# EAGLE design schematic (EAGLE 9.4.1)
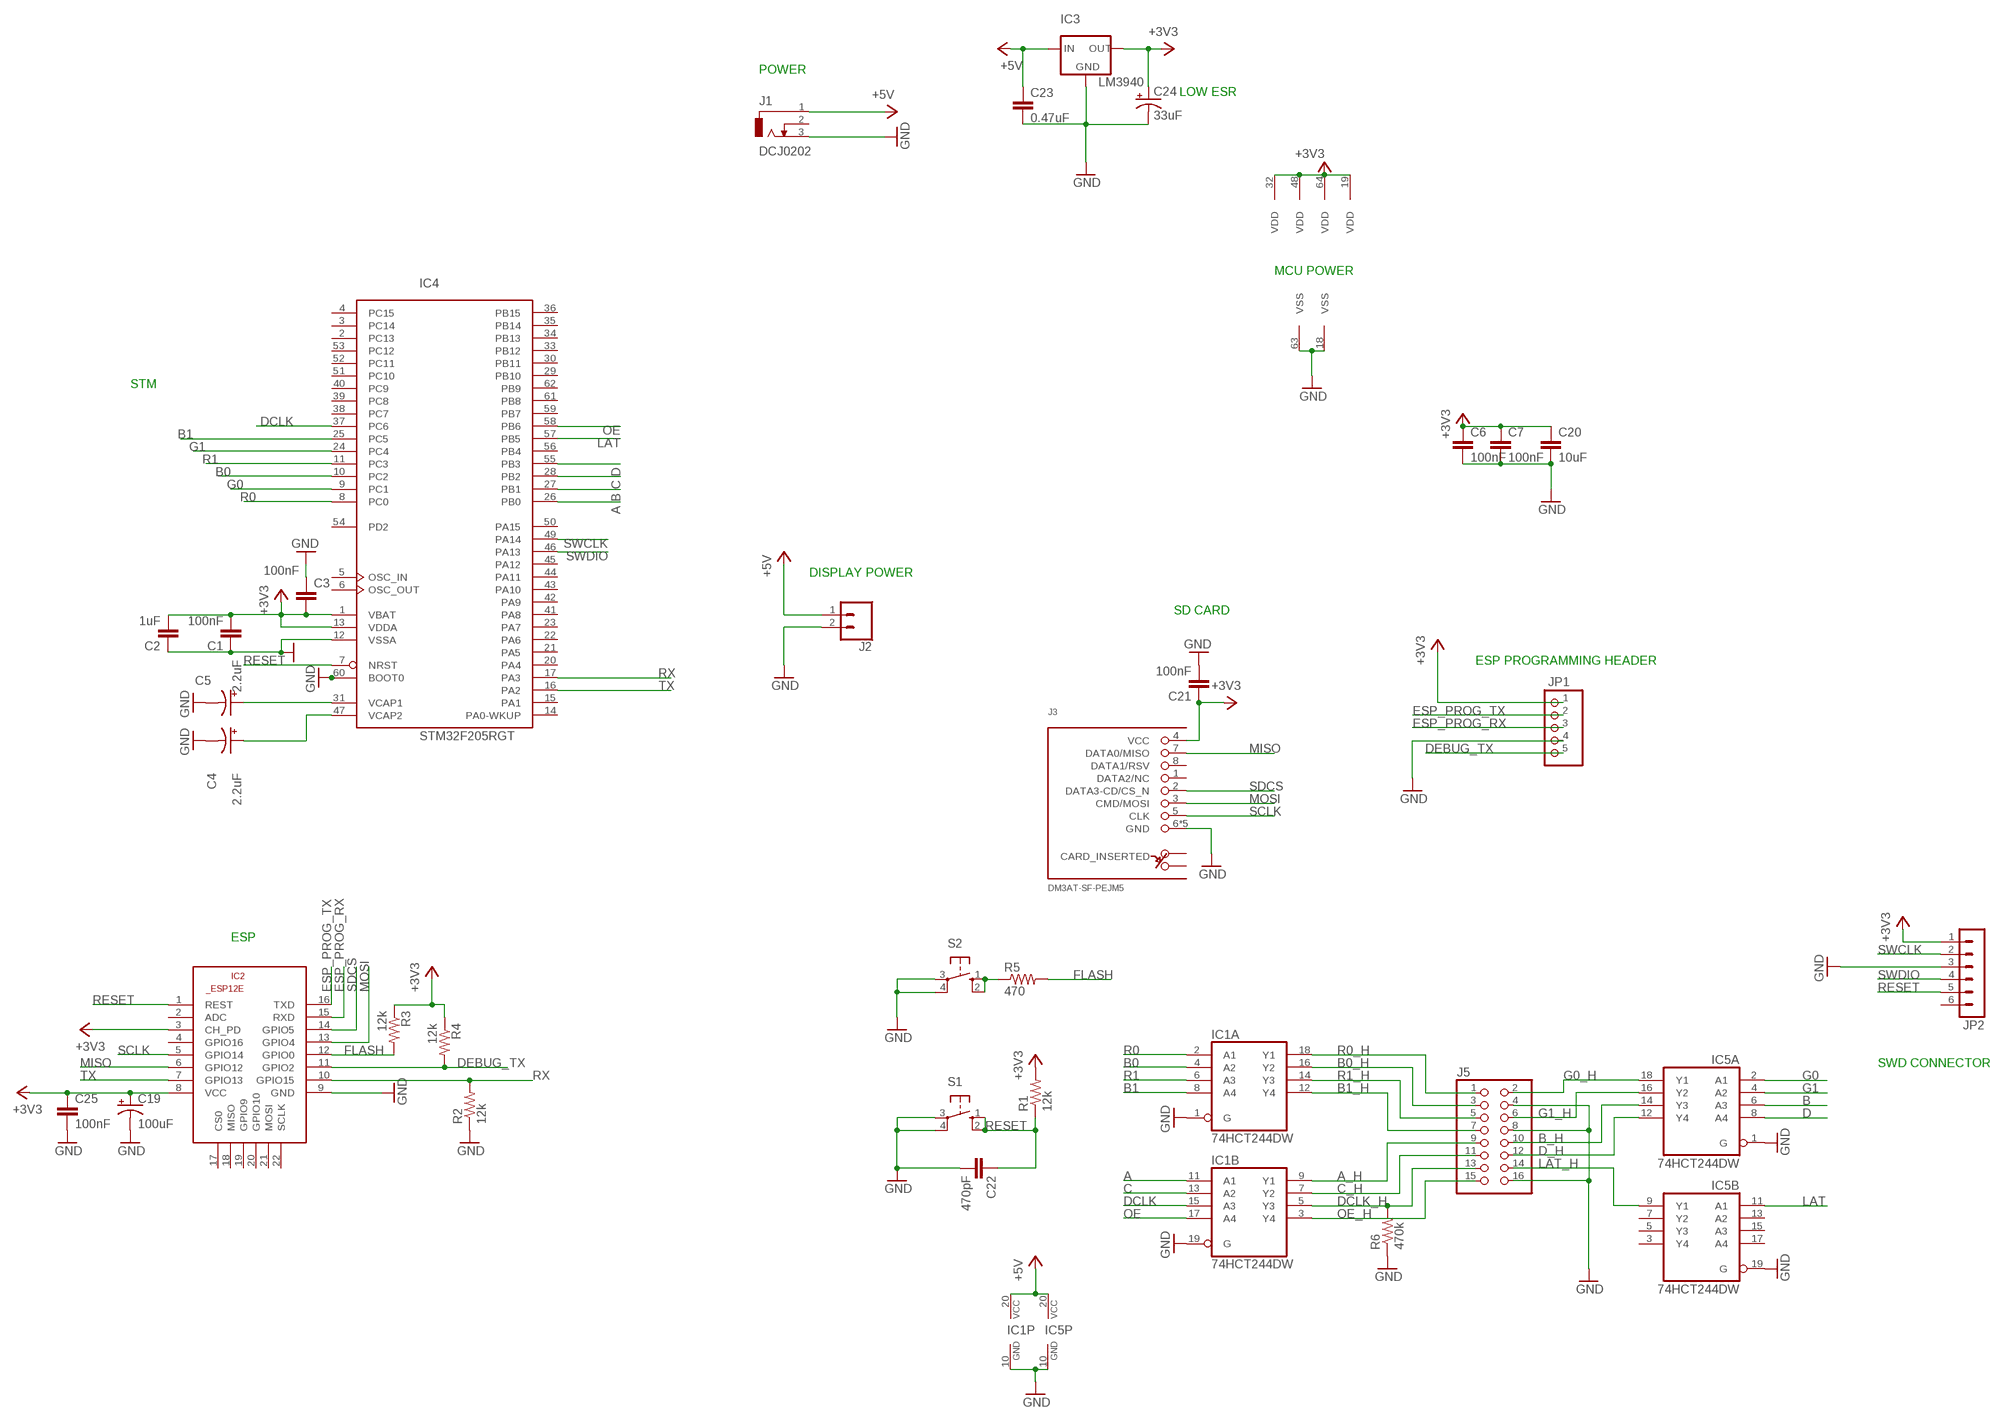
[diagram p0: schematic, sheet 1]

## Parts
C1  100nF  C-EU025-025X050  [C025-025X050]
C2  1uF  C-EU050-024X044  [C050-024X044]
C3  100nF  C-EU025-025X050  [C025-025X050]
C4  2.2uF  CPOL-USE1.8-4  [E1,8-4]
C5  2.2uF  CPOL-USE1.8-4  [E1,8-4]
C6  100nF  C-EU025-025X050  [C025-025X050]
C7  100nF  C-EU025-025X050  [C025-025X050]
C19  100uF  CPOL-USE2.5-6  [E2,5-6]
C20  10uF  C-EU025-025X050  [C025-025X050]
C21  100nF  C-EU025-025X050  [C025-025X050]
C22  470pF  C-EU025-025X050  [C025-025X050]
C23  0.47uF  C-EU050-024X044  [C050-024X044]
C24  33uF  CPOL-USE2-5  [E2-5]
C25  100nF  C-EU025-025X050  [C025-025X050]
IC1  74HCT244DW  [SO20W]
IC2  ESP8266-12EESP12E  [ESP8266-ESP12E]
IC3  LM3940  [TO220]
IC4  STM32F205RGT  [LQFP64]
IC5  74HCT244DW  [SO20W]
J1  DCJ0202  [DCJ0202]
J2  CONN_025MM  [SCREWTERMINAL-5MM-2]
J3  DM3AT-SF-PEJM5  [DM3AT-SF-PEJM5]
J5  PINHD-2X8  [2X08]
JP1  PINHD-1X5  [1X05]
JP2  MA06-1  [MA06-1]
R1  12k  R-US_0204/7  [0204/7]
R2  12k  R-US_0204/7  [0204/7]
R3  12k  R-US_0204/7  [0204/7]
R4  12k  R-US_0204/7  [0204/7]
R5  470  R-US_0204/7  [0204/7]
R6  470k  R-US_0204/7  [0204/7]
S1  10-XX  [B3F-10XX]
S2  10-XX  [B3F-10XX]

## Nets
+3V3: C6.1 C7.1 C19.+ C20.1 C21.1 C24.+ C25.1 IC2.3(CH_PD) IC2.8(VCC) IC3.3(OUT) IC4.19(VDD) IC4.32(VDD) IC4.48(VDD) IC4.64(VDD) J3.4(VCC) JP1.1 JP2.1 R1.2 R3.1 R4.1
+5V: C23.1 IC1.20(P:VCC) IC3.1(IN) IC5.20(P:VCC) J1.1 J2.1
A: IC1.11(B:A1) IC4.26(PB0)
A_H: IC1.9(B:Y1) J5.9
B: IC4.27(PB1) IC5.6(A:A3)
B0: IC1.4(A:A2) IC4.10(PC2)
B0_H: IC1.16(A:Y2) J5.3
B1: IC1.8(A:A4) IC4.25(PC5)
B1_H: IC1.12(A:Y4) J5.7
B_H: IC5.14(A:Y3) J5.10
C: IC1.13(B:A2) IC4.28(PB2)
C_H: IC1.7(B:Y2) J5.11
D: IC4.55(PB3) IC5.8(A:A4)
D_H: IC5.12(A:Y4) J5.12
DCLK: IC1.15(B:A3) IC4.37(PC6)
DCLK_H: IC1.5(B:Y3) J5.13 R6.2
DEBUG_TX: IC2.11(GPIO2) JP1.5 R4.2
ESP_PROG_RX: IC2.15(RXD) JP1.3
ESP_PROG_TX: IC2.16(TXD) JP1.2
FLASH: IC2.12(GPIO0) R3.2 R5.2
G0: IC4.9(PC1) IC5.2(A:A1)
G0_H: IC5.18(A:Y1) J5.2
G1: IC4.24(PC4) IC5.4(A:A2)
G1_H: IC5.16(A:Y2) J5.6
GND: C1.1 C2.1 C3.1 C4.- C5.- C6.2 C7.2 C19.- C20.2 C21.2 C22.2 C23.2 C24.- C25.2 IC1.1(A:G) IC1.10(P:GND) IC1.19(B:G) IC2.9(GND) IC3.2(GND) IC4.12(VSSA) IC4.18(VSS) IC4.60(BOOT0) IC4.63(VSS) IC5.1(A:G) IC5.10(P:GND) IC5.19(B:G) J1.3 J2.2 J3.6(GND) J3.MOUNT0(GND) J3.MOUNT1(GND) J3.MOUNT2(GND) J3.MOUNT3(GND) J5.4 J5.8 J5.16 JP1.4 JP2.3 R2.1 R6.1 S1.3(P) S1.4(P1) S2.3(P) S2.4(P1)
LAT: IC4.57(PB5) IC5.11(B:A1)
LAT_H: IC5.9(B:Y1) J5.14
MISO: IC2.6(GPIO12) J3.7(DATA0/MISO)
MOSI: IC2.13(GPIO4) J3.3(CMD/MOSI)
N$1: R5.1 S2.1(S) S2.2(S1)
N$2: C5.+ IC4.31(VCAP1)
N$3: C4.+ IC4.47(VCAP2)
N$4: C1.2 C2.2 C3.2 IC4.1(VBAT) IC4.13(VDDA) ; supply symbol labelled +3V3
OE: IC1.17(B:A4) IC4.58(PB6)
OE_H: IC1.3(B:Y4) J5.15
R0: IC1.2(A:A1) IC4.8(PC0)
R0_H: IC1.18(A:Y1) J5.1
R1: IC1.6(A:A3) IC4.11(PC3)
R1_H: IC1.14(A:Y3) J5.5
RESET: C22.1 IC2.1(REST) IC4.7(NRST) JP2.5 R1.1 S1.1(S) S1.2(S1)
RX: IC2.10(GPIO15) IC4.17(PA3) R2.2
SCLK: IC2.5(GPIO14) J3.5(CLK)
SDCS: IC2.14(GPIO5) J3.2(DATA3-CD/CS_N)
SWCLK: IC4.49(PA14) JP2.2
SWDIO: IC4.46(PA13) JP2.4
TX: IC2.7(GPIO13) IC4.16(PA2)
Unconnected: IC2.2(ADC) IC2.4(GPIO16) IC2.17(CS0) IC2.18(MISO) IC2.19(GPIO9) IC2.20(GPIO10) IC2.21(MOSI) IC2.22(SCLK) IC4.2(PC13) IC4.3(PC14) IC4.4(PC15) IC4.5(OSC_IN) IC4.6(OSC_OUT) IC4.14(PA0-WKUP) IC4.15(PA1) IC4.20(PA4) IC4.21(PA5) IC4.22(PA6) IC4.23(PA7) IC4.29(PB10) IC4.30(PB11) IC4.33(PB12) IC4.34(PB13) IC4.35(PB14) IC4.36(PB15) IC4.38(PC7) IC4.39(PC8) IC4.40(PC9) IC4.41(PA8) IC4.42(PA9) IC4.43(PA10) IC4.44(PA11) IC4.45(PA12) IC4.50(PA15) IC4.51(PC10) IC4.52(PC11) IC4.53(PC12) IC4.54(PD2) IC4.56(PB4) IC4.59(PB7) IC4.61(PB8) IC4.62(PB9) IC5.3(B:Y4) IC5.5(B:Y3) IC5.7(B:Y2) IC5.13(B:A2) IC5.15(B:A3) IC5.17(B:A4) J1.2 J3.1(DATA2/NC) J3.8(DATA1/RSV) J3.A J3.B JP2.6

## Notes on the sheet
- POWER
- LOW ESR
- MCU POWER
- STM
- DISPLAY POWER
- SD CARD
- ESP PROGRAMMING HEADER
- ESP
- SWD CONNECTOR

## Library data of the parts
C1-C3 C6 C7 C20-C23 C25 = rcl:C-EU: CAPACITOR, European symbol; SPICEPREFIX: C
C4 C5 C19 C24 = rcl:CPOL-US: POLARIZED CAPACITOR, American symbol; SPICEPREFIX: C
IC1 IC5 = 74xx-eu:74*244: Octal BUFFER and LINE DRIVER, 3-state
IC2 = esp12e:ESP8266-12E: ESP8266-12E Library for Eagle CAD The author not responsible for any damages or errors!. Created by Suhail jr.lt;/author>
IC3 = LM3940:LM3940: LM3940 1A Low Dropout Regulator for 5V to 3.3V Conversion; AVAILABILITY: Unavailable; MF: National Semiconductor; MP: LM3940; PACKAGE: None; PRICE: None
IC4 = micro-stm_v3:STM32F205R*T: ARM 32-bit Cortex™-M3 CPU 120 MHz maximum frequency 128 to 1024 Kbytes of Flash memory 64 to 128 kbytes of SRAM 51 GPIOs 1.8 to 3.6 V application supply
J1 = con-jack:DCJ0202: DC POWER JACK Source: DCJ0202.pdf; OC_FARNELL: unknown; OC_NEWARK: unknown
J2 = SparkFun-Connectors:CONN_02: Multi connection point. Often used as Generic Header-pin footprint for 0.1 inch spaced/style header connections On any of the 0.1 inch spaced packages, you can populate with these: Break Away Headers - Straight <https://www.sparkfun.com/products/116> (PRT-00116) Break Away Male Headers - Right Angle <https://www.sparkfun.com/products/553> (PRT-00553) Female Headers <https://www.sparkfun.com/products/115> (PRT-00115) Break Away Headers - Machine Pin <https://www.sparkfun.com/products/117> (PRT-00117) Break Away Female Headers - Swiss Machine Pin <https://www.sparkfun.com/products/743> (PRT-00743) For SCREWTERMINALS and SPRING TERMINALS visit here: Screw Terimnals on SparkFun.com <https://www.sparkfun.com/search/results?term=Screw+Terminals> (5mm/3.5mm/2.54mm spacing) This device is also useful as a general connection point to wire up your design to another part of your project. Our various solder wires solder well into these plated through hole pads. Hook-Up Wire - Assortment (Stranded, 22 AWG) <https://www.sparkfun.com/products/11375> (PRT-11375) Hook-Up Wire - Assortment (Solid Core, 22 AWG) <https://www.sparkfun.com/products/11367> (PRT-11367) View the entire wire category on our website here <https://www.sparkfun.com/categories/141> Special notes: Molex polarized connector foot print use with: PRT-08233 with associated crimp pins and housings. 2.54_SCREWTERM for use with PRT-10571. 3.5mm Screw Terminal footprints for PRT-08084 5mm Screw Terminal footprints for use with PRT-08432; SF_SKU: PRT-08432
J3 = connector:DM3AT-SF-PEJM5: CONN MICRO SD R/A PUSH-PUSH SMD; DESCRIPTION: CONN MICRO SD CARD PUSH-PUSH R/A; DIGIKEY: HR1964CT-ND; MANUFACTURER: Hirose Electric Co Ltd; MPN: DM3AT-SF-PEJM5
J5 = pinhead:PINHD-2X8: PIN HEADER
JP1 = pinhead:PINHD-1X5: PIN HEADER
JP2 = con-lstb:MA06-1: PIN HEADER; OC_FARNELL: unknown; OC_NEWARK: unknown
R1-R6 = rcl:R-US_: RESISTOR, American symbol; SPICEPREFIX: R
S1 S2 = switch-omron:10-XX: OMRON SWITCH; MPN: B3F-1000; OC_FARNELL: 176432; OC_NEWARK: 36M3542

## Board
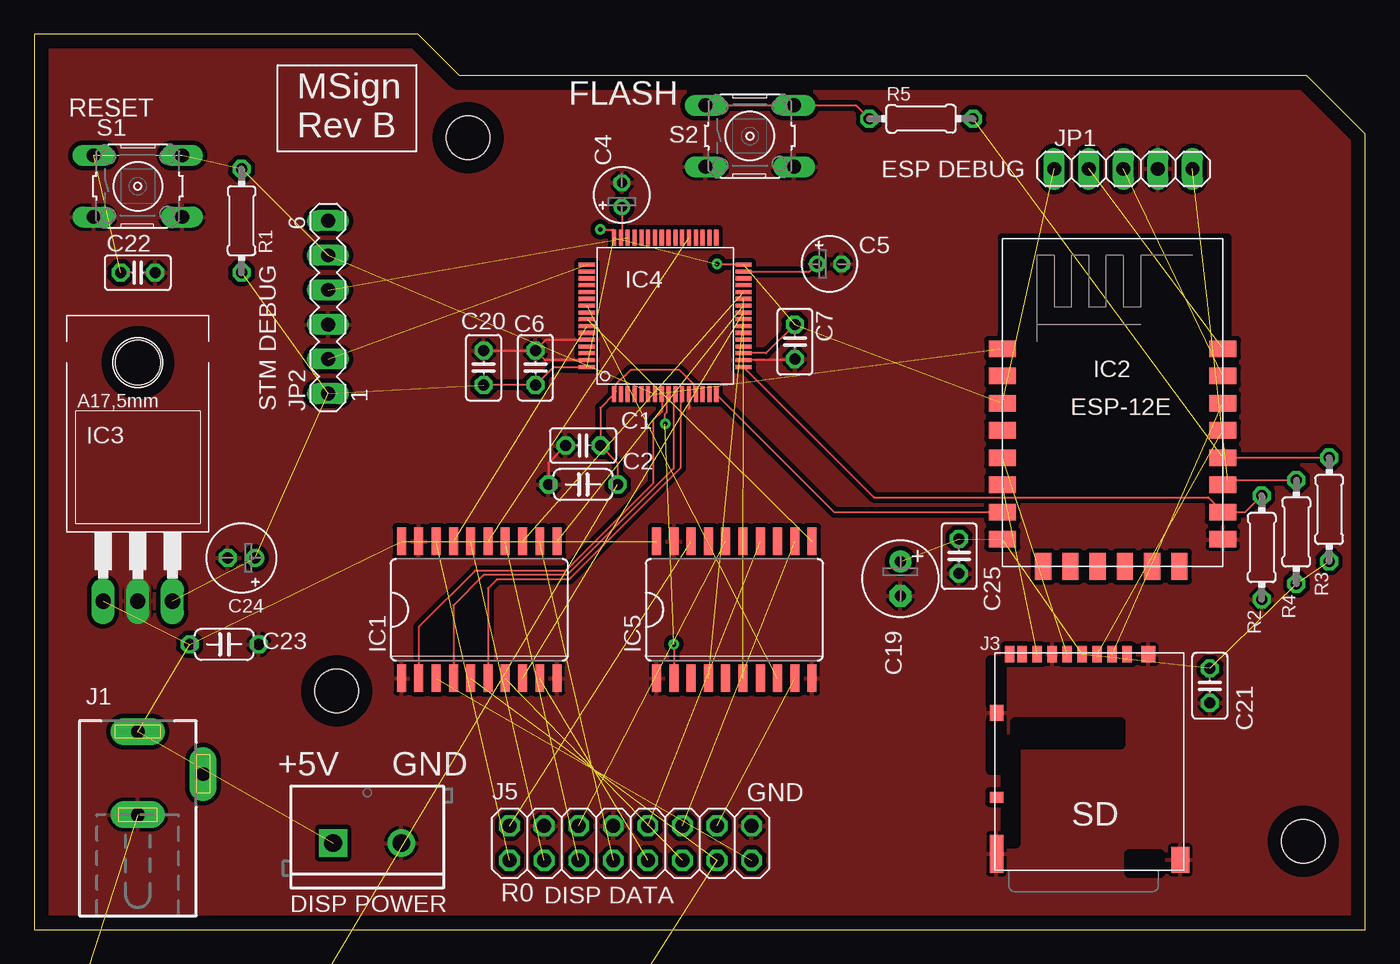
[diagram p1: board, top side]
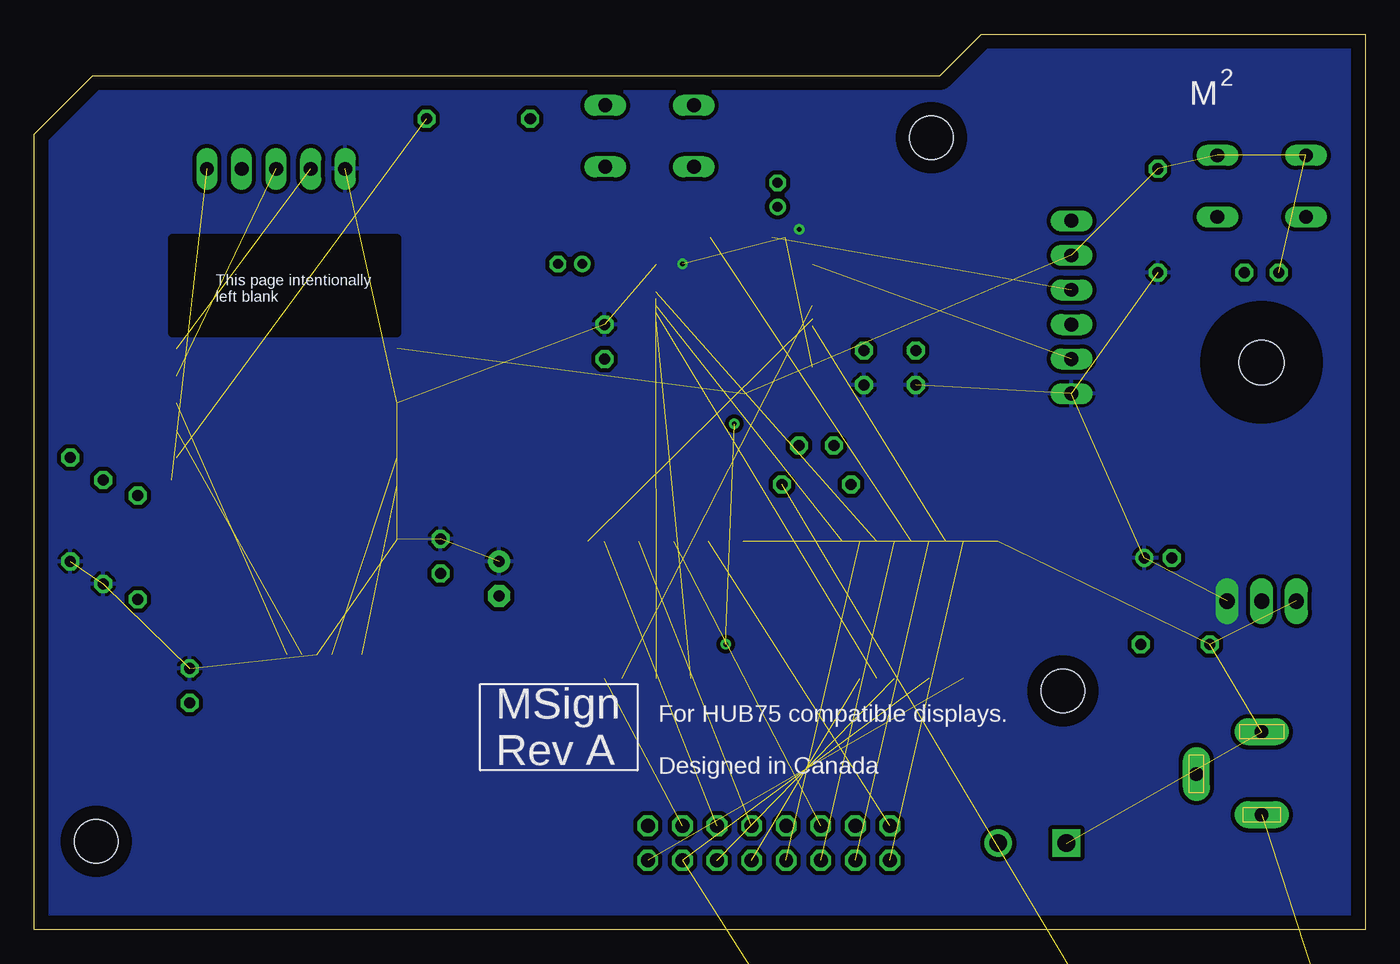
[diagram p2: board, bottom side, seen from below]

Size 97.79 x 65.79 mm. Coordinates in mm from the lower left corner, seen from the top.
Outline: 0,0 97.79,0 97.79,58.42 93.47,62.74 31.24,62.74 28.19,65.79 0,65.79 0,0
Copper layers (1*16): Top 0.035mm / dielectric 1.5mm / Bottom 0.035mm
Design rules "default": minimum track width 6mil, minimum drill 0.35mm, track to track 6mil, track to pad 6mil, pad to pad 6mil, via to via 6mil, smd to smd 6mil, copper to edge 40mil, drill to drill 6mil, minimum pad ring 10mil, minimum via ring 8mil, stop-mask expansion 4mil, vias tented up to drill 0mil, thermal gap 10mil
Holes 3.2 mm at 31.88,58.17 22.23,17.53 93.22,6.48

### Footprints (pad centres in the part's own frame; a part is rotated, then mirrored left to right if it is on the bottom)
C025-025X050 = drill 0.813 octagon: 1 -1.27,0; 2 1.27,0
C050-024X044 = drill 0.813 octagon: 1 -2.54,0; 2 2.54,0
E1,8-4 = drill 0.711 pad 1.168: + -0.889,0 | drill 0.711 pad 1.168 octagon: - 0.889,0
E2,5-6 = drill 0.813 pad 1.6: + -1.27,0 | drill 0.813 pad 1.6 octagon: - 1.27,0
E2-5 = drill 0.813 pad 1.27: + -1.016,0 | drill 0.813 pad 1.27 octagon: - 1.016,0
SO20W = smd 0.66 x 2.032: 1 -5.715,-5.029; 2 -4.445,-5.029; 3 -3.175,-5.029; 4 -1.905,-5.029; 5 -0.635,-5.029; 6 0.635,-5.029; 7 1.905,-5.029; 8 3.175,-5.029; 9 4.445,-5.029; 10 5.715,-5.029; 11 5.715,5.029; 12 4.445,5.029; 13 3.175,5.029; 14 1.905,5.029; 15 0.635,5.029; 16 -0.635,5.029; 17 -1.905,5.029; 18 -3.175,5.029; 19 -4.445,5.029; 20 -5.715,5.029
ESP8266-ESP12E = smd 2 x 1.2: 1 -7.62,5.84; 2 -7.62,3.84; 3 -7.62,1.84; 4 -7.62,-0.16; 5 -7.62,-2.16; 6 -7.62,-4.16; 7 -7.62,-6.16; 8 -7.62,-8.16; 9 8.58,-8.16; 10 8.58,-6.16; 11 8.58,-4.16; 12 8.58,-2.16; 13 8.58,-0.16; 14 8.58,1.84; 15 8.58,3.84; 16 8.58,5.84 | smd 1.2 x 2: 17 -4.62,-10.16; 18 -2.62,-10.16; 19 -0.62,-10.16; 20 1.38,-10.16; 21 3.38,-10.16; 22 5.38,-10.16
TO220 = drill 1.118 long: 1 -2.54,-10.16; 2 0,-10.16; 3 2.54,-10.16 | hole 3.302: 0,7.366
LQFP64 = smd 0.3 x 1.2: 1 -3.75,-5.75; 2 -3.25,-5.75; 3 -2.75,-5.75; 4 -2.25,-5.75; 5 -1.75,-5.75; 6 -1.25,-5.75; 7 -0.75,-5.75; 8 -0.25,-5.75; 9 0.25,-5.75; 10 0.75,-5.75; 11 1.25,-5.75; 12 1.75,-5.75; 13 2.25,-5.75; 14 2.75,-5.75; 15 3.25,-5.75; 16 3.75,-5.75; 33 3.75,5.75; 34 3.25,5.75; 35 2.75,5.75; 36 2.25,5.75; 37 1.75,5.75; 38 1.25,5.75; 39 0.75,5.75; 40 0.25,5.75; 41 -0.25,5.75; 42 -0.75,5.75; 43 -1.25,5.75; 44 -1.75,5.75; 45 -2.25,5.75; 46 -2.75,5.75; 47 -3.25,5.75; 48 -3.75,5.75 | smd 1.2 x 0.3: 17 5.75,-3.75; 18 5.75,-3.25; 19 5.75,-2.75; 20 5.75,-2.25; 21 5.75,-1.75; 22 5.75,-1.25; 23 5.75,-0.75; 24 5.75,-0.25; 25 5.75,0.25; 26 5.75,0.75; 27 5.75,1.25; 28 5.75,1.75; 29 5.75,2.25; 30 5.75,2.75; 31 5.75,3.25; 32 5.75,3.75; 49 -5.75,3.75; 50 -5.75,3.25; 51 -5.75,2.75; 52 -5.75,2.25; 53 -5.75,1.75; 54 -5.75,1.25; 55 -5.75,0.75; 56 -5.75,0.25; 57 -5.75,-0.25; 58 -5.75,-0.75; 59 -5.75,-1.25; 60 -5.75,-1.75; 61 -5.75,-2.25; 62 -5.75,-2.75; 63 -5.75,-3.25; 64 -5.75,-3.75
DCJ0202 = drill 1 pad 2 long: 1 0,3.1; 2 4.8,0; 3 0,-3
SCREWTERMINAL-5MM-2 = drill 1.3 pad 2.032 square: 1 0,0 | drill 1.3 pad 2.032: 2 5,0
DM3AT-SF-PEJM5 = smd 0.7 x 1.2: 1 3.2,-0.1; 2 2.1,-0.1; 3 1,-0.1; 4 -0.1,-0.1; 5 -1.2,-0.1; 6 -2.3,-0.1; 7 -3.4,-0.1; 8 -4.5,-0.1; B -5.45,-0.1 | smd 1 x 0.8: A -6.4,-10.6 | smd 1 x 1.2: MOUNT0 4.75,-0.1; MOUNT1 -6.4,-4.4 | smd 1 x 2.8: MOUNT2 -6.4,-14.75 | smd 1.3 x 1.9: MOUNT3 7.1,-15.2
2X08 = drill 1.016 octagon: 1 -8.89,-1.27; 2 -8.89,1.27; 3 -6.35,-1.27; 4 -6.35,1.27; 5 -3.81,-1.27; 6 -3.81,1.27; 7 -1.27,-1.27; 8 -1.27,1.27; 9 1.27,-1.27; 10 1.27,1.27; 11 3.81,-1.27; 12 3.81,1.27; 13 6.35,-1.27; 14 6.35,1.27; 15 8.89,-1.27; 16 8.89,1.27
1X05 = drill 1.016 long: 1 -5.08,0; 2 -2.54,0; 3 0,0; 4 2.54,0; 5 5.08,0
MA06-1 = drill 1.016 long: 1 -6.35,0; 2 -3.81,0; 3 -1.27,0; 4 1.27,0; 5 3.81,0; 6 6.35,0
0204/7 = drill 0.813 octagon: 1 -3.81,0; 2 3.81,0
B3F-10XX = drill 1.016 long: 1 -3.251,2.261; 2 3.251,2.261; 3 -3.251,-2.261; 4 3.251,-2.261

### Placement (x,y rotation side)
C1  40.32,35.56 0 top
C2  40.32,32.7 0 top
C3  -12.7,-58.42 0 top  (outside the outline)
C4  43.18,53.98 90 top
C5  58.42,48.9 0 top
C6  36.83,41.27 90 top
C7  55.88,43.18 270 top
C19  63.63,25.78 270 top
C20  33.02,41.27 90 top
C21  86.36,17.91 270 top
C22  7.62,48.26 0 top
C23  13.97,20.95 0 top
C24  15.24,27.3 180 top
C25  67.94,27.43 270 top
IC1  32.7,23.5 0 top
IC2  78.74,36.83 0 top
IC3  7.62,34.29 0 top
IC4  46.35,45.09 0 top
IC5  51.44,23.5 0 top
J1  7.62,11.43 0 top
J2  21.97,6.35 0 top
J3  77.09,20.32 0 top
J5  43.81,6.35 0 top
JP1  80.01,55.88 0 top
JP2  21.59,45.72 90 top
R1  15.24,52.07 270 top
R2  90.17,28.07 90 top
R3  95.12,30.86 90 top
R4  92.71,29.21 90 top
R5  65.15,59.56 0 top
R6  -10.79,-84.77 0 top  (outside the outline)
S1  7.62,54.61 0 top
S2  52.58,58.29 0 top

### Tracks (layer width: path | path; a pad name or v marks a point on that pad's centre or on a via)
+3V3  (via drill 0.35)  (16 unrouted)
  Top 0.152: C7.1 53.77,42.34 IC4.19 | IC4.64 38.16,41.34 C6.1 C20.1 | v50.16,48.9 52.05,48.9 IC4.32 | v41.59,51.44 42.55,51.44 42.6,51.38 IC4.48
  pour Bottom (isolate 0.305, rank 6): -0.13,65.91 97.79,65.91 97.79,0 -0.13,0
  pour Bottom (no thermals): 8.89,26.04 8.89,22.23 11.43,22.23 11.43,26.04
+5V  (5 unrouted)
A  (1 unrouted)
A_H  (1 unrouted)
B  (1 unrouted)
B0
  Top 0.152: IC4.10 46.98,39.21 46.98,33.85 39.17,26.04 33.02,26.04 30.8,23.81 IC1.4
B0_H  (1 unrouted)
B1  (1 unrouted)
B1_H  (1 unrouted)
B_H  (1 unrouted)
C  (1 unrouted)
C_H  (1 unrouted)
D  (1 unrouted)
D_H  (1 unrouted)
DCLK  (1 unrouted)
DCLK_H  (2 unrouted)
DEBUG_TX  (1 unrouted)
  Top 0.152: IC2.11 87.67,33.02 R4.2
ESP_PROG_RX  (1 unrouted)
ESP_PROG_TX  (1 unrouted)
FLASH  (1 unrouted)
  Top 0.152: IC2.12 R3.2
G0  (via drill 0.35)  (1 unrouted)
  Top 0.152: v46.99,20.95 IC5.2 | v46.35,37.15 46.35,37.88 46.48,38.01 46.48,39.21 IC4.9
G0_H  (1 unrouted)
G1  (1 unrouted)
G1_H  (1 unrouted)
GND  (2 unrouted)
  Top 0.152: C7.2 55.8,41.84 IC4.18 | IC4.63 37.54,41.84 C6.2 | C6.2 37.62,43.34 IC4.60 | C20.2 C6.2 | C1.1 37.78,34.29 C2.1 | IC4.12 48.1,38.26
  pour Top (isolate 0.33, rank 6): 0,65.91 97.79,65.91 97.79,0 0,0
  pour Top (no thermals): 6.67,25.72 6.67,22.23 8.57,22.23 8.57,26.04 6.67,26.04
LAT  (1 unrouted)
LAT_H  (1 unrouted)
MISO  (1 unrouted)
MOSI  (1 unrouted)
N$1
  Top 0.152: R5.1 60.35,60.55 55.88,60.55 S2.2 S2.1
N$2
  Top 0.152: IC4.31 56.97,48.34 C5.+
N$3
  Top 0.152: C4.+ 43.18,50.91 IC4.47
N$4  (1 unrouted)
  Top 0.152: C2.2 42.86,34.29 C1.2 41.59,38.32 IC4.1 42.73,39.46 42.73,40.03 43.81,41.12 47.4,41.12 48.48,40.03 48.48,39.46 IC4.13
OE  (1 unrouted)
OE_H  (1 unrouted)
R0
  Top 0.152: IC4.8 46.1,38.06 45.47,37.43 45.47,32.77 39.05,26.35 32.38,26.35 28.26,22.23 IC1.2
R0_H  (1 unrouted)
R1
  Top 0.152: IC4.11 47.48,39.21 47.48,33.92 39.29,25.73 34,25.73 33.34,25.07 IC1.6 33.34,17.78
R1_H  (1 unrouted)
RESET  (6 unrouted)
RX
  Top 0.152: IC4.17 61.69,31.75 86.24,31.75 IC2.10 88.96,30.67 R2.2
SCLK  (1 unrouted)
SDCS  (1 unrouted)
SWCLK  (1 unrouted)
SWDIO  (1 unrouted)
TX
  Top 0.152: IC4.16 58.77,30.67 IC2.7

### Text on the board
tPlace: FLASH | RESET | MSign / Rev B | ESP DEBUG | STM DEBUG | +5V | GND | GND | SD | R0 | DISP DATA | DISP POWER
bPlace: 2 | M | This page intentionally / left blank | MSign / Rev A | For HUB75 compatible displays. / / Designed in Canada